# Altium schematic sheet Relay.SchDoc
size A4
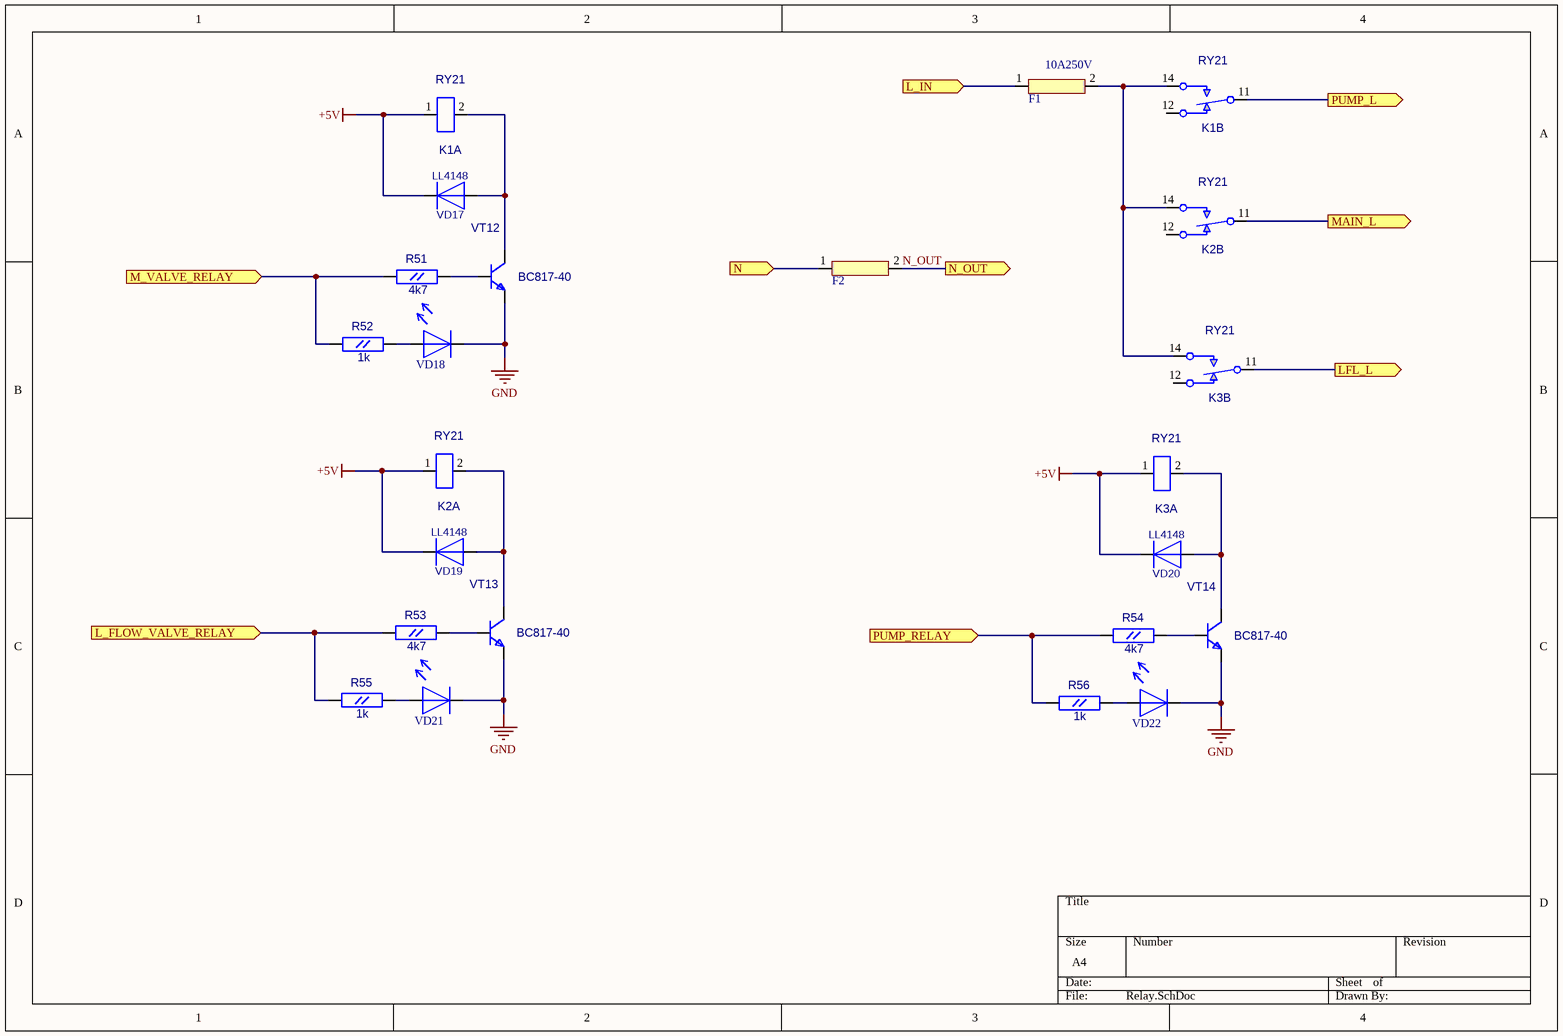
[diagram p0: Relay.SchDoc]

## Parts
F1  KLS5-266(5x20) 2pcs  [Fuse_5x20]  (value not drawn)
F2  KLS5-266(5x20) 2pcs  [Fuse_5x20]  (value not drawn)
K1  RY21  [RY21_RY21(Primary)]  (parts A,B of 2)
K2  RY21  [RY21_RY21(Primary)]  (parts A,B of 2)
K3  RY21  [RY21_RY21(Primary)]  (parts A,B of 2)
R51  4k7  [RC0603]
R52  1k  [RC0603]
R53  4k7  [RC0603]
R54  4k7  [RC0603]
R55  1k  [RC0603]
R56  1k  [RC0603]
VD17  LL4148  [SOD-80]
VD18  LED_0805  [LED0805]  (value not drawn)
VD19  LL4148  [SOD-80]
VD20  LL4148  [SOD-80]
VD21  LED_0805  [LED0805]  (value not drawn)
VD22  LED_0805  [LED0805]  (value not drawn)
VT12  BC817-40  [SOT-23(123)]
VT13  BC817-40  [SOT-23(123)]
VT14  BC817-40  [SOT-23(123)]

## Ports
L_FLOW_VALVE_RELAY (in), L_IN (in), LFL_L (out), M_VALVE_RELAY (in), MAIN_L (out), N (in), N_OUT (out), PUMP_L (out), PUMP_RELAY (in)

## Nets
+5V: K1.1(L1) K2.1(L1) K3.1(L1) VD17.2(+) VD19.2(+) VD20.2(+)
GND: VD18.2 VD21.2 VD22.2 VT12.2(E) VT13.2(E) VT14.2(E)
L_FLOW_VALVE_RELAY: R53.1(A) R55.1(A) ; port L_FLOW_VALVE_RELAY
L_IN: F1.1 ; port L_IN
LFL_L: K3.11(C1) ; port LFL_L
M_VALVE_RELAY: R51.1(A) R52.1(A) ; port M_VALVE_RELAY
MAIN_L: K2.11(C1) ; port MAIN_L
N: F2.1 ; port N
N_OUT: F2.2 ; port N_OUT
PUMP_L: K1.11(C1) ; port PUMP_L
PUMP_RELAY: R54.1(A) R56.1(A) ; port PUMP_RELAY
NetF1_2: F1.2 K1.14(C2) K2.14(C2) K3.14(C2)
NetK1_2: K1.2(C2) VD17.1(-) VT12.3(C)
NetK2_2: K2.2(C2) VD19.1(-) VT13.3(C)
NetK3_2: K3.2(C2) VD20.1(-) VT14.3(C)
NetR51_2: R51.2(B) VT12.1(B)
NetR52_2: R52.2(B) VD18.1
NetR53_2: R53.2(B) VT13.1(B)
NetR54_2: R54.2(B) VT14.1(B)
NetR55_2: R55.2(B) VD21.1
NetR56_2: R56.2(B) VD22.1

Not connected (* = marked no-connect by the designer): K1 12(C3); K2 12(C3); K3 12(C3)

## Notes on the sheet
- (near F1) 10A250V

## Library data of the parts
F1 F2 = Fuse KLS5-266(5x20): Value: KLS5-266(5x20) 2pcs
R51-R56 = RC0603
  R51 R53 R54: Value: 4k7
  R52 R55 R56: Value: 1k
VT12-VT14 = BC846BLT1: NPN 500ma transistor; ComponentField7: Published 29-Sep-2000; OriginalName: BC846BLT1; Value: BC817-40
K1-K3 = RY21: Value: *
VD17 VD19 VD20 = LL4148: Value: *
VD18 VD21 VD22 = LED_0805: Value: LED_0805